# Altium schematic sheet TX41391_TX4139.schdoc.schdoc
size 127 x 101 mm
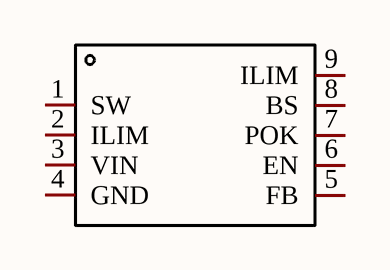
[diagram p0: TX41391_TX4139.schdoc.schdoc]

## Parts
U?  TX4139  [SOIC-8_L4.9-W3.9-P1.27-LS6.0-BL-EP]  (value not drawn)

## Nets

Not connected (* = marked no-connect by the designer): U? 1(SW) 2(ILIM) 3(VIN) 4(GND) 5(FB) 6(EN) 7(POK) 8(BS) 9(ILIM)

## Library data of the parts
U? = TX4139: Manufacturer: XDS(芯鼎盛); Add into BOM: yes; Function: 降压型; Symbol: TX4139; Device: TX4139; Supplier: LCSC; Supplier Part: C329266; Manufacturer Part: TX4139; JLCPCB Part Class: Extended Part; LCSC Part Name: TX4139; Supplier Footprint: SOIC-8-EP; Datasheet: https://atta.szlcsc.com/upload/public/pdf/source/20181114/C329266_CD6855C5E3D63BB015021EA380507028.pdf; Convert to PCB: yes; Input Voltage: -; Output Current (Max): -; Switching Frequency: -; Synchronous Rectification: -; Number of Outputs: -; Topology: -